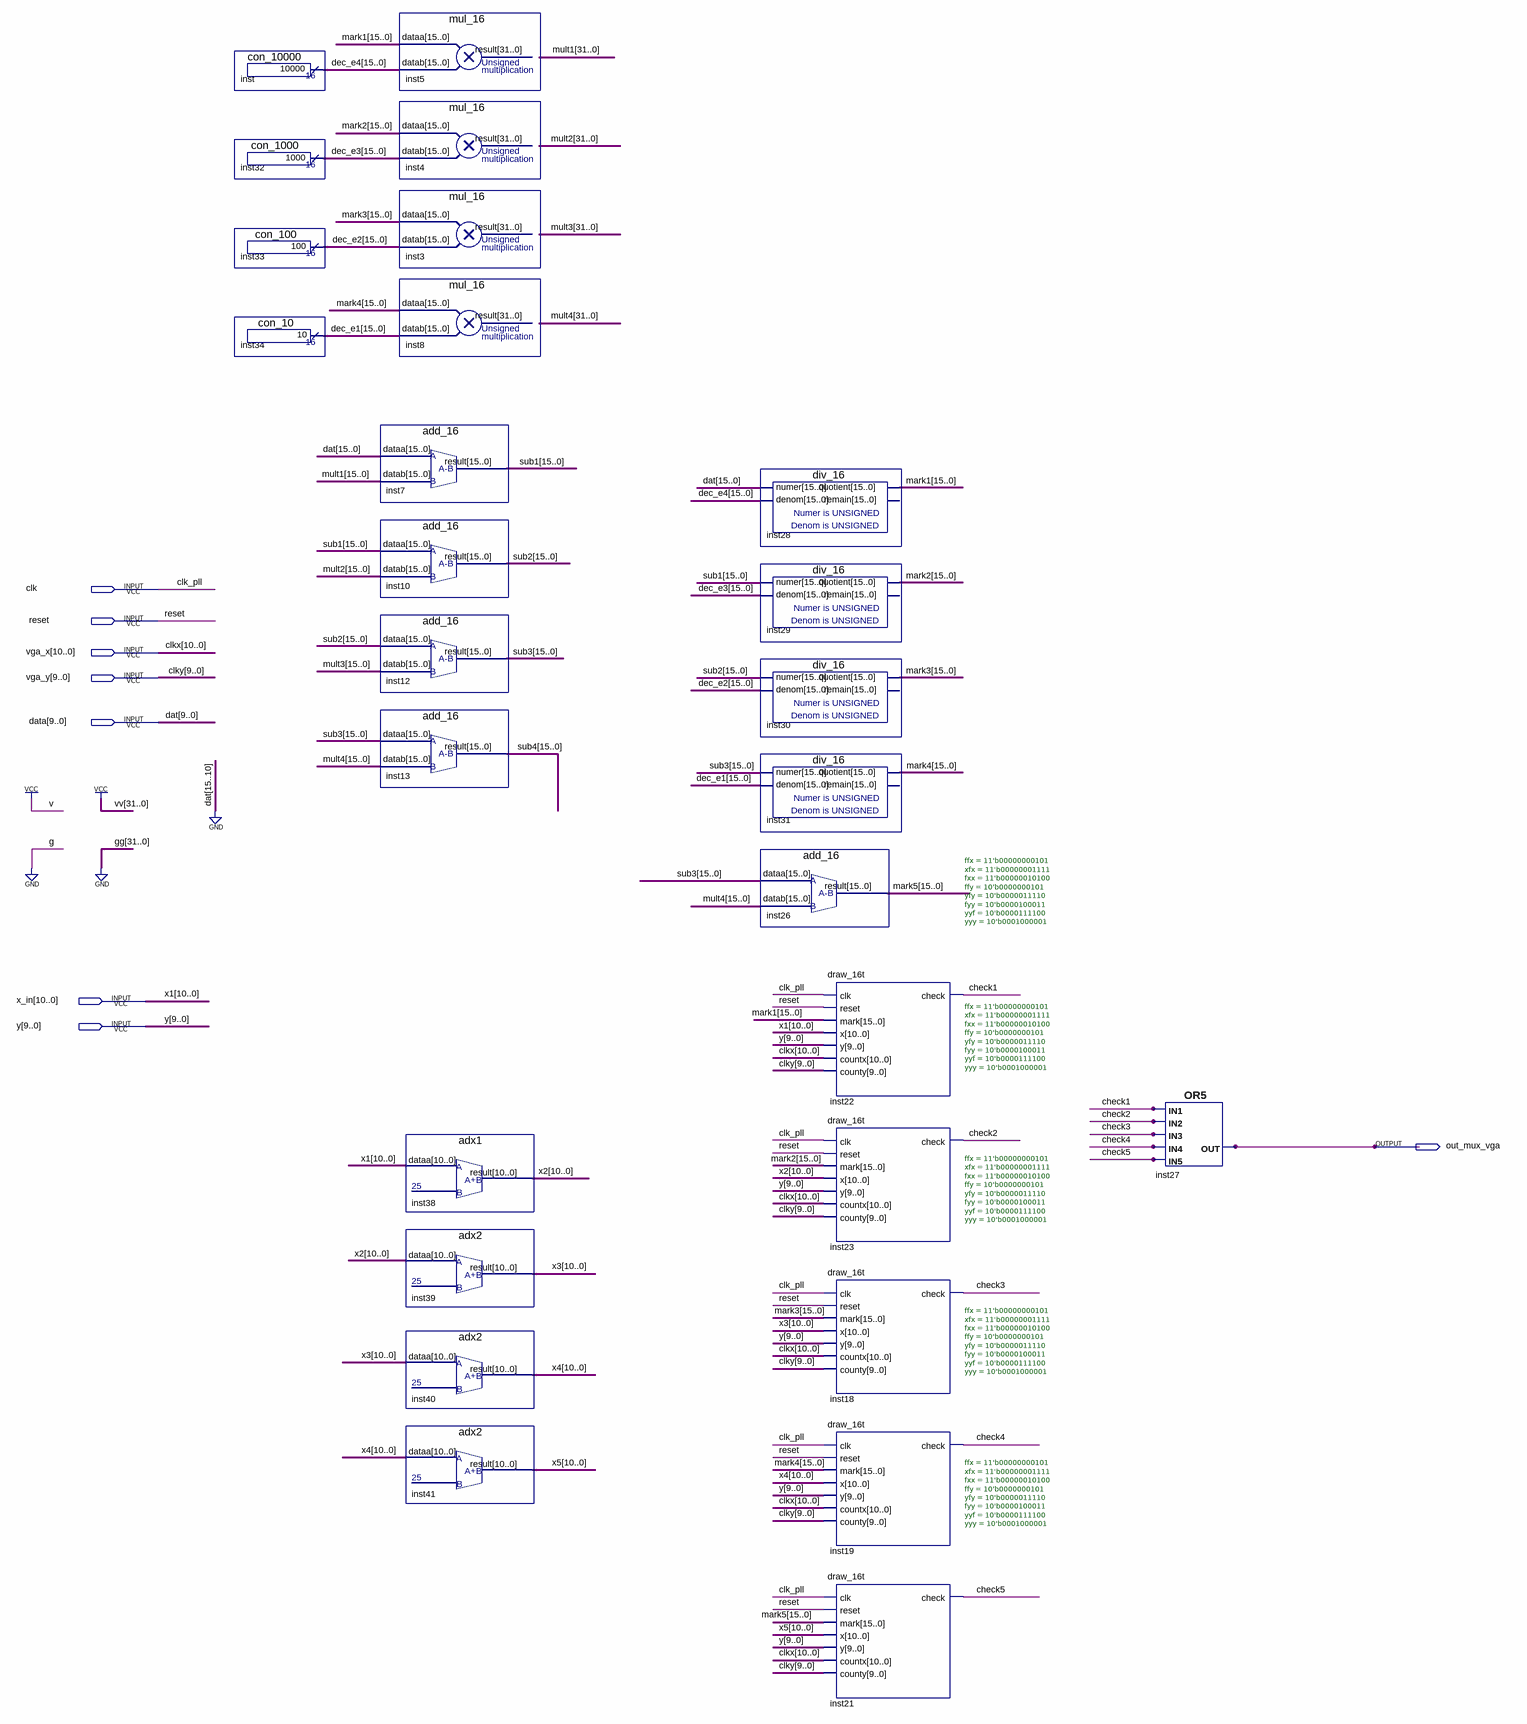
[diagram p0: schematic sheet]
// Quartus schematic num_10t.bdf as structural Verilog: 27 symbols, 8 pins
module num_10t (
  input  clk,
  input  reset,
  input  [10:0] vga_x,
  input  [9:0] vga_y,
  input  [9:0] data,
  input  [10:0] x_in,
  input  [9:0] y,
  output out_mux_vga
);

  wire check1, check2, check3, check4, check5;
  wire [10:0] x2, x3, x4, x5;
  wire [15:0] dec_e1, dec_e2, dec_e3, dec_e4, mark1, mark2, mark3, mark4, mark5, sub1, sub2, sub3, sub4;
  wire [31:0] mult1, mult2, mult3, mult4;

  con_10000 inst (.result(dec_e4));
  con_1000 inst32 (.result(dec_e3));
  con_100 inst33 (.result(dec_e2));
  con_10 inst34 (.result(dec_e1));
  add_16 inst7 (.dataa({{6{1'b0}}, data}), .datab(mult1[15:0]), .result(sub1));
  add_16 inst10 (.dataa(sub1), .datab(mult2[15:0]), .result(sub2));
  add_16 inst12 (.dataa(sub2), .datab(mult3[15:0]), .result(sub3));
  add_16 inst13 (.dataa(sub3), .datab(mult4[15:0]), .result(sub4));
  mul_16 inst5 (.dataa(mark1), .datab(dec_e4), .result(mult1));
  mul_16 inst4 (.dataa(mark2), .datab(dec_e3), .result(mult2));
  mul_16 inst3 (.dataa(mark3), .datab(dec_e2), .result(mult3));
  mul_16 inst8 (.dataa(mark4), .datab(dec_e1), .result(mult4));
  adx1 inst38 (.dataa(x_in), .result(x2));
  adx2 inst39 (.dataa(x2), .result(x3));
  adx2 inst40 (.dataa(x3), .result(x4));
  adx2 inst41 (.dataa(x4), .result(x5));
  div_16 inst28 (.numer({{6{1'b0}}, data}), .denom(dec_e4), .quotient(mark1));  // open: remain
  div_16 inst29 (.numer(sub1), .denom(dec_e3), .quotient(mark2));  // open: remain
  div_16 inst30 (.numer(sub2), .denom(dec_e2), .quotient(mark3));  // open: remain
  div_16 inst31 (.numer(sub3), .denom(dec_e1), .quotient(mark4));  // open: remain
  add_16 inst26 (.dataa(sub3), .datab(mult4[15:0]), .result(mark5));
  draw_16t #(.ffx(11'b00000000101), .xfx(11'b00000001111), .fxx(11'b00000010100), .ffy(10'b0000000101), .yfy(10'b0000011110), .fyy(10'b0000100011), .yyf(10'b0000111100), .yyy(10'b0001000001)) inst22 (
    .clk(clk), .reset(reset), .mark(mark1), .x(x_in), .y(y), .countx(vga_x), .county(vga_y), .check(check1));
  draw_16t #(.ffx(11'b00000000101), .xfx(11'b00000001111), .fxx(11'b00000010100), .ffy(10'b0000000101), .yfy(10'b0000011110), .fyy(10'b0000100011), .yyf(10'b0000111100), .yyy(10'b0001000001)) inst23 (
    .clk(clk), .reset(reset), .mark(mark2), .x(x2), .y(y), .countx(vga_x), .county(vga_y), .check(check2));
  draw_16t #(.ffx(11'b00000000101), .xfx(11'b00000001111), .fxx(11'b00000010100), .ffy(10'b0000000101), .yfy(10'b0000011110), .fyy(10'b0000100011), .yyf(10'b0000111100), .yyy(10'b0001000001)) inst18 (
    .clk(clk), .reset(reset), .mark(mark3), .x(x3), .y(y), .countx(vga_x), .county(vga_y), .check(check3));
  draw_16t #(.ffx(11'b00000000101), .xfx(11'b00000001111), .fxx(11'b00000010100), .ffy(10'b0000000101), .yfy(10'b0000011110), .fyy(10'b0000100011), .yyf(10'b0000111100), .yyy(10'b0001000001)) inst19 (
    .clk(clk), .reset(reset), .mark(mark4), .x(x4), .y(y), .countx(vga_x), .county(vga_y), .check(check4));
  draw_16t #(.ffx(11'b00000000101), .xfx(11'b00000001111), .fxx(11'b00000010100), .ffy(10'b0000000101), .yfy(10'b0000011110), .fyy(10'b0000100011), .yyf(10'b0000111100), .yyy(10'b0001000001)) inst21 (
    .clk(clk), .reset(reset), .mark(mark5), .x(x5), .y(y), .countx(vga_x), .county(vga_y), .check(check5));
  or inst27 (out_mux_vga, check1, check2, check3, check4, check5);

  // Other names for the same wires on the sheet: clk_pll = clk; clkx[10:0] = vga_x; clky[9:0] = vga_y;
  //   dat[9:0] = data; x1[10:0] = x_in
endmodule
